# Altium project eEPS.PrjPcb
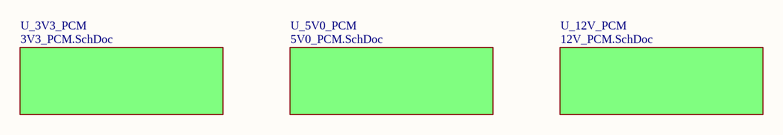
[diagram p0: PCMS.SchDoc]
9 sheets, 133 parts. Net scope: global (net labels, ports and power ports of the same name join across sheets).
Board file: eEPS.PcbDoc
Sheets:
  PCMS.SchDoc
    U_5V0_PCM = 5V0_PCM.SchDoc
    U_12V_PCM = 12V_PCM.SchDoc
    U_3V3_PCM = 3V3_PCM.SchDoc
  MCU.SchDoc
  CONNECTORS.SchDoc
    SHARED_HEADER = SHARED_HEADER.SchDoc
    JUMPERS = JUMPERS.SchDoc
  CURRENT_SENSE.SchDoc

## Sheet PCMS.SchDoc
size A4

### Sub-sheets
U_3V3_PCM = 3V3_PCM.SchDoc: no entries
U_5V0_PCM = 5V0_PCM.SchDoc: no entries
U_12V_PCM = 12V_PCM.SchDoc: no entries

## Sheet 5V0_PCM.SchDoc
size A4
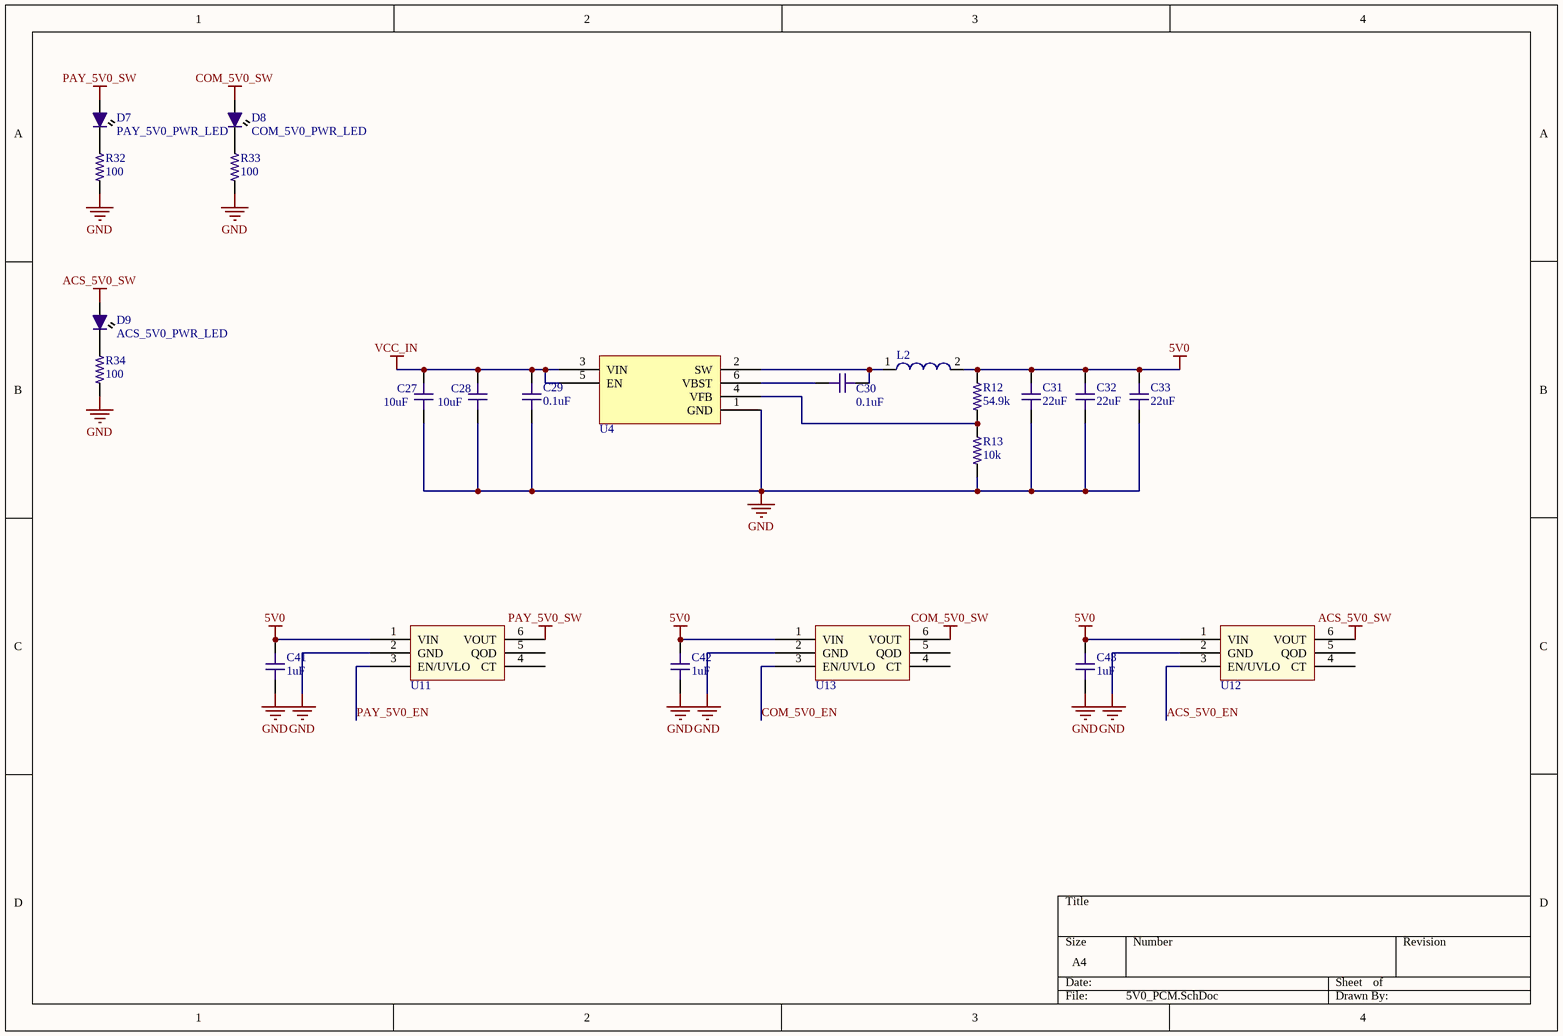
[diagram p1: 5V0_PCM.SchDoc]

### Parts
C27  value 10uF  [C1206-IPC]  (hidden comment: Cin)
C28  value 10uF  [C1206-IPC]  (hidden comment: Cin)
C29  value 0.1uF  [C0603-IPC]  (hidden comment: Cinx)
C30  value 0.1uF  [C0603-IPC]  (hidden comment: Cbst)
C31  value 22uF  [C0603-IPC]  (hidden comment: Cout)
C32  value 22uF  [C0603-IPC]  (hidden comment: Cout)
C33  value 22uF  [C0603-IPC]  (hidden comment: Cout)
C41  value 1uF  [C0603-IPC]  (hidden comment: Capacitor)
C42  value 1uF  [C0603-IPC]  (hidden comment: Capacitor)
C43  value 1uF  [C0603-IPC]  (hidden comment: Capacitor)
D7  PAY_5V0_PWR_LED  [LED0603-IPC]
D8  COM_5V0_PWR_LED  [LED0603-IPC]
D9  ACS_5V0_PWR_LED  [LED0603-IPC]
L2  74437349033  [WE-LHMI 7050]  (value not drawn)
R12  value 54.9k  [R0402-IPC]  (hidden comment: Rfbt)
R13  value 10k  [R0402-IPC]  (hidden comment: Rfbb)
R32  value 100  [R0603-IPC]  (hidden comment: 0603 Template)
R33  value 100  [R0603-IPC]  (hidden comment: 0603 Template)
R34  value 100  [R0603-IPC]  (hidden comment: 0603 Template)
U4  Buck  [SOT23-6_L]  (value not drawn)
U11  One Channel Load Switch  [TPS22810-Q1]  (value not drawn)
U12  One Channel Load Switch  [TPS22810-Q1]  (value not drawn)
U13  One Channel Load Switch  [TPS22810-Q1]  (value not drawn)

### Nets
5V0: C31.2 C32.2 C33.2 C41.2 C42.2 C43.2 L2.2 R12.2 U11.1(VIN) U12.1(VIN) U13.1(VIN)
ACS_5V0_SW: D9.A U12.6(VOUT)
COM_5V0_SW: D8.A U13.6(VOUT)
GND: C27.1 C28.1 C29.1 C31.1 C32.1 C33.1 C41.1 C42.1 C43.1 R13.1 R32.2 R33.2 R34.2 U4.1(GND) U11.2(GND) U12.2(GND) U13.2(GND)
PAY_5V0_SW: D7.A U11.6(VOUT)
VCC_IN: C27.2 C28.2 C29.2 U4.3(VIN) U4.5(EN)
ACS_5V0_EN: U12.3(EN/UVLO)
COM_5V0_EN: U13.3(EN/UVLO)
PAY_5V0_EN: U11.3(EN/UVLO)
NetC30_1: C30.1 U4.6(VBST)
NetC30_2: C30.2 L2.1 U4.2(SW)
NetD7_K: D7.K R32.1
NetD8_K: D8.K R33.1
NetD9_K: D9.K R34.1
NetR12_1: R12.1 R13.2 U4.4(VFB)

Not connected (* = marked no-connect by the designer): U11 4(CT) 5(QOD); U12 4(CT) 5(QOD); U13 4(CT) 5(QOD)

### Library data of the parts
C27 C28 = 15: Capacitor (1206) 10uF 25V X5R 1206; OrbitPartId: 15; Type: Passive; EIA Code: X5R; Max. Voltage: 25V; PartId: 1; Subtype: Capacitor; ComponentLink1Description: 12063D106KAT2A; ComponentLink1URL: https://www.digikey.ca/en/products/detail/avx-corporation/12063D106KAT2A/1950914
C29 C30 = 13: Cap Cer 0.1uF 10% 25V Cer Cap X7R 0603; OrbitPartId: 13; Type: Passive; EIA Code: X7R; Max. Voltage: 25V; PartId: 1; Subtype: Capacitor; ComponentLink1Description: C0603C104K3RACTU; ComponentLink1URL: https://www.digikey.ca/en/products/detail/kemet/C0603C104K3RACTU/416044?s=N4IgTCBcDaIMIAYBsCDMcCMCAsBpVASgIJwAqAqiALoC%2BQA
C31-C33 = 13: Cap Cer 22uF 10V X5R 0603; OrbitPartId: 13; Type: Passive; EIA Code: X5R; Max. Voltage: 10V; PartId: 1; Subtype: Capacitor; ComponentLink1Description: C1608X5R1A226M080AC; ComponentLink1URL: https://www.digikey.ca/en/products/detail/tdk-corporation/C1608X5R1A226M080AC/3661560?s=N4IgTCBcDaIMIEYBsAGAHADQKwCUEEEwwkBZdFfOEAXQF8g
C41-C43 = 13: Capacitor (0603); OrbitPartId: 13; EIA Code: X5R; Max. Voltage: 16V; Type: Passive; PartId: 1; Subtype: Capacitor
D7-D9 = LED 0603 SMD: Red PWR_LED; Supplier 1: Digi-Key; Supplier Part Number 1: 732-4966-1-ND
L2 = CMP-1353-00061-1: SMD Power Inductor WE-LHMI, L=3.3 µH; Manufacturer: Wuerth Elektronik; Inductance: 3.3 ÂµH; ComponentLink2Description: Datasheet; PartNumber: 74437349033; ComponentLink2URL: http://katalog.we-online.de/kataloge/eisos/media/pdf/74437349033.pdf; PackageReference: WE-LHMI 7050; ComponentLink1Description: Manufacturer URL; ComponentLink1URL: http://www.we-online.com
R12 = 19: 54.9k 1% 0402; OrbitPartId: 19; PartId: 1; Type: Passive; Subtype: Resistor; ComponentLink1Description: CRCW040254K9FKED; ComponentLink1URL: https://www.digikey.ca/en/products/detail/vishay-dale/crcw040254k9fked/1178205
R13 = 19: 10k 1% 0402; OrbitPartId: 19; PartId: 1; Type: Passive; Subtype: Resistor; ComponentLink1Description: CRCW040210K0FKED; ComponentLink1URL: https://www.digikey.ca/en/products/detail/vishay-dale/CRCW040210K0FKED/1178121
R32-R34 = 0603 Template: Chip Resistor, 0603, 51hms, 0.1W
U4 = TPS565208DDC: 4.5V tp 17V, 5A Synchronous Step-Down Voltage Regulator; ComponentLink1Description: Datasheet; ComponentLink1URL: http://www.ti.com/lit/ds/symlink/tps565208.pdf
U11-U13 = TPS22810-Q1: 2.7 - 18V @ 2A Max

## Sheet 12V_PCM.SchDoc
size A4
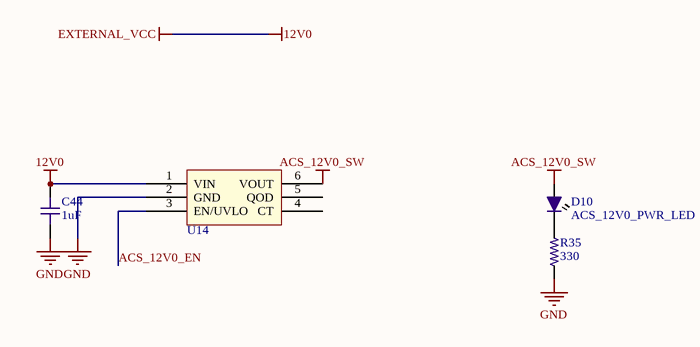
[diagram p2: 12V_PCM.SchDoc]

### Parts
C44  value 1uF  [C0603-IPC]  (hidden comment: Capacitor)
D10  ACS_12V0_PWR_LED  [LED0603-IPC]
R35  value 330  [R0603-IPC]  (hidden comment: 0603 Template)
U14  One Channel Load Switch  [TPS22810-Q1]  (value not drawn)

### Nets
12V0: C44.2 U14.1(VIN)  [also labelled EXTERNAL_VCC]
ACS_12V0_SW: D10.A U14.6(VOUT)
GND: C44.1 R35.2 U14.2(GND)
ACS_12V0_EN: U14.3(EN/UVLO)
NetD10_K: D10.K R35.1

Not connected (* = marked no-connect by the designer): U14 4(CT) 5(QOD)

### Library data of the parts
C44 = 13: as C41 on sheet 5V0_PCM; PartId: 1; Subtype: Capacitor
D10 = LED 0603 SMD: Red PWR_LED; Supplier 1: Digi-Key; Supplier Part Number 1: 732-4966-1-ND
R35 = 0603 Template: Chip Resistor, 0603, 51hms, 0.1W
U14 = TPS22810-Q1: 2.7 - 18V @ 2A Max

## Sheet 3V3_PCM.SchDoc
size A4
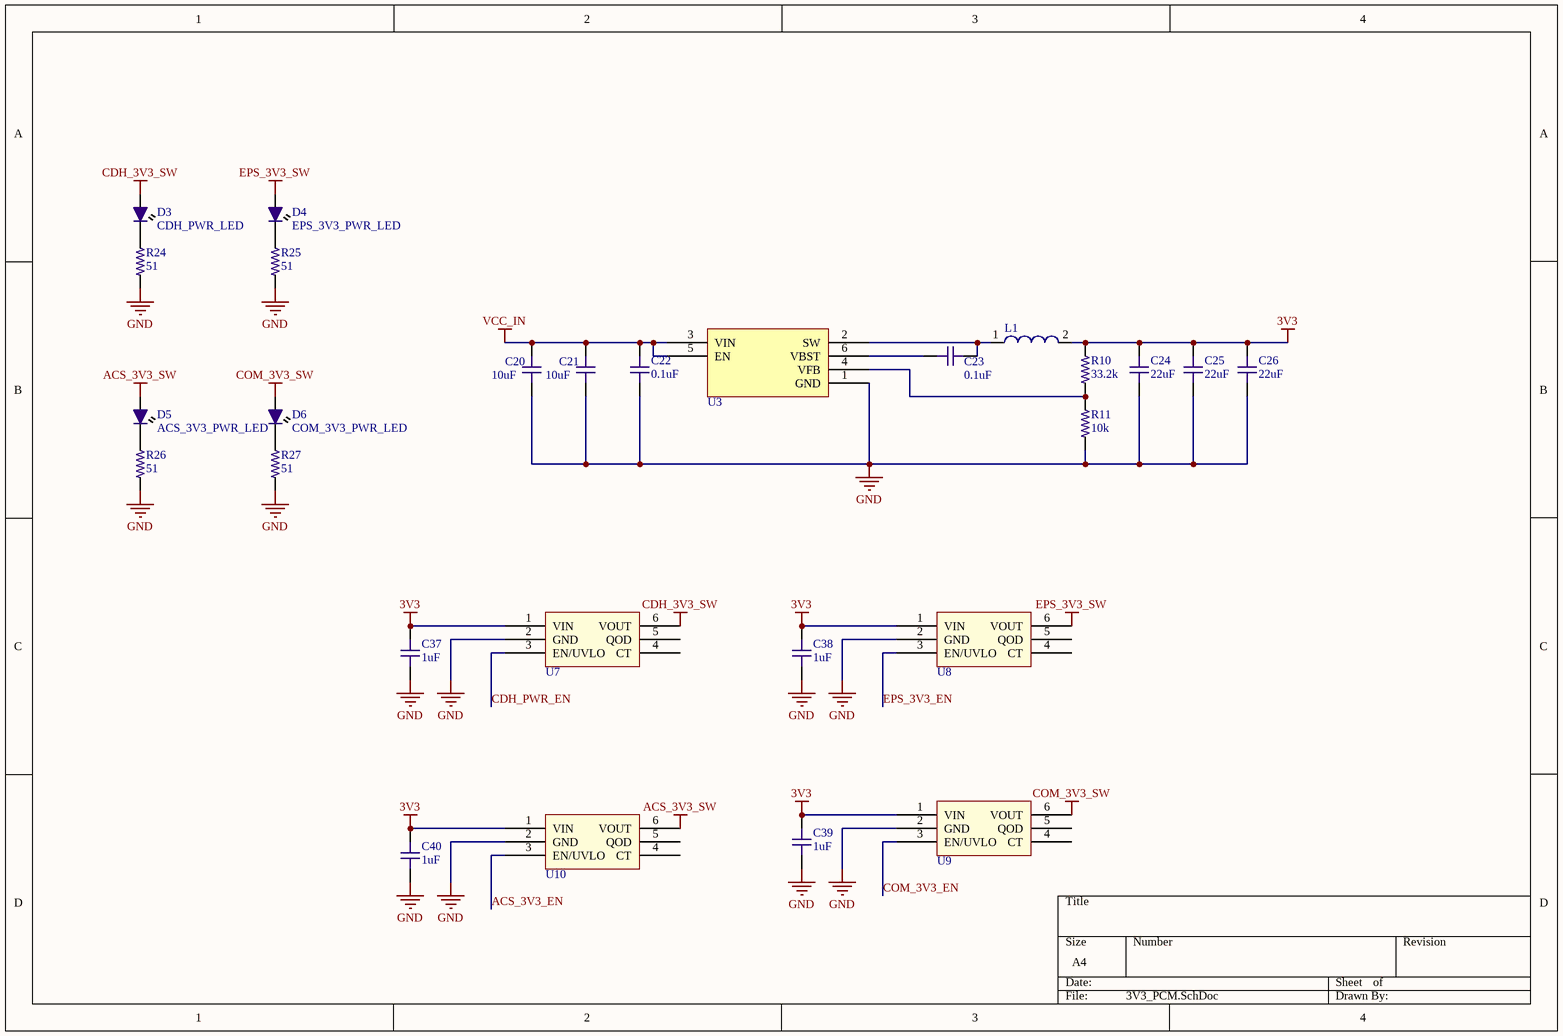
[diagram p3: 3V3_PCM.SchDoc]

### Parts
C20  value 10uF  [C1206-IPC]  (hidden comment: Cin)
C21  value 10uF  [C1206-IPC]  (hidden comment: Cin)
C22  value 0.1uF  [C0603-IPC]  (hidden comment: Cinx)
C23  value 0.1uF  [C0603-IPC]  (hidden comment: Cbst)
C24  value 22uF  [C0603-IPC]  (hidden comment: Cout)
C25  value 22uF  [C0603-IPC]  (hidden comment: Cout)
C26  value 22uF  [C0603-IPC]  (hidden comment: Cout)
C37  value 1uF  [C0603-IPC]  (hidden comment: Capacitor)
C38  value 1uF  [C0603-IPC]  (hidden comment: Capacitor)
C39  value 1uF  [C0603-IPC]  (hidden comment: Capacitor)
C40  value 1uF  [C0603-IPC]  (hidden comment: Capacitor)
D3  CDH_PWR_LED  [LED0603-IPC]
D4  EPS_3V3_PWR_LED  [LED0603-IPC]
D5  ACS_3V3_PWR_LED  [LED0603-IPC]
D6  COM_3V3_PWR_LED  [LED0603-IPC]
L1  74437349022  [WE-LHMI 7050]  (value not drawn)
R10  value 33.2k  [R0402-IPC]  (hidden comment: Rfbt)
R11  value 10k  [R0402-IPC]  (hidden comment: Rfbb)
R24  value 51  [R0603-IPC]  (hidden comment: 0603 Template)
R25  value 51  [R0603-IPC]  (hidden comment: 0603 Template)
R26  value 51  [R0603-IPC]  (hidden comment: 0603 Template)
R27  value 51  [R0603-IPC]  (hidden comment: 0603 Template)
U3  Buck  [SOT23-6_L]  (value not drawn)
U7  One Channel Load Switch  [TPS22810-Q1]  (value not drawn)
U8  One Channel Load Switch  [TPS22810-Q1]  (value not drawn)
U9  One Channel Load Switch  [TPS22810-Q1]  (value not drawn)
U10  One Channel Load Switch  [TPS22810-Q1]  (value not drawn)

### Nets
3V3: C24.2 C25.2 C26.2 C37.2 C38.2 C39.2 C40.2 L1.2 R10.2 U7.1(VIN) U8.1(VIN) U9.1(VIN) U10.1(VIN)
ACS_3V3_SW: D5.A U10.6(VOUT)
CDH_3V3_SW: D3.A U7.6(VOUT)
COM_3V3_SW: D6.A U9.6(VOUT)
EPS_3V3_SW: D4.A U8.6(VOUT)
GND: C20.1 C21.1 C22.1 C24.1 C25.1 C26.1 C37.1 C38.1 C39.1 C40.1 R11.1 R24.2 R25.2 R26.2 R27.2 U3.1(GND) U7.2(GND) U8.2(GND) U9.2(GND) U10.2(GND)
VCC_IN: C20.2 C21.2 C22.2 U3.3(VIN) U3.5(EN)
ACS_3V3_EN: U10.3(EN/UVLO)
CDH_PWR_EN: U7.3(EN/UVLO)
COM_3V3_EN: U9.3(EN/UVLO)
EPS_3V3_EN: U8.3(EN/UVLO)
NetC23_1: C23.1 U3.6(VBST)
NetC23_2: C23.2 L1.1 U3.2(SW)
NetD3_K: D3.K R24.1
NetD4_K: D4.K R25.1
NetD5_K: D5.K R26.1
NetD6_K: D6.K R27.1
NetR10_1: R10.1 R11.2 U3.4(VFB)

Not connected (* = marked no-connect by the designer): U7 4(CT) 5(QOD); U8 4(CT) 5(QOD); U9 4(CT) 5(QOD); U10 4(CT) 5(QOD)

### Library data of the parts
C20 C21 = 15: as C27 on sheet 5V0_PCM; EIA Code: X5R; Max. Voltage: 25V; PartId: 1; Subtype: Capacitor; ComponentLink1Description: 12063D106KAT2A; ComponentLink1URL: https://www.digikey.ca/en/products/detail/avx-corporation/12063D106KAT2A/1950914
C22 C23 = 13: as C29 on sheet 5V0_PCM; EIA Code: X7R; Max. Voltage: 25V; PartId: 1; Subtype: Capacitor; ComponentLink1Description: C0603C104K3RACTU; ComponentLink1URL: https://www.digikey.ca/en/products/detail/kemet/C0603C104K3RACTU/416044?s=N4IgTCBcDaIMIAYBsCDMcCMCAsBpVASgIJwAqAqiALoC%2BQA
C24-C26 = 13: as C31 on sheet 5V0_PCM; EIA Code: X5R; Max. Voltage: 10V; PartId: 1; Subtype: Capacitor; ComponentLink1Description: C1608X5R1A226M080AC; ComponentLink1URL: https://www.digikey.ca/en/products/detail/tdk-corporation/C1608X5R1A226M080AC/3661560?s=N4IgTCBcDaIMIEYBsAGAHADQKwCUEEEwwkBZdFfOEAXQF8g
C37-C40 = 13: as C41 on sheet 5V0_PCM; PartId: 1; Subtype: Capacitor
D3-D6 = LED 0603 SMD: Red PWR_LED; Supplier 1: Digi-Key; Supplier Part Number 1: 732-4966-1-ND
L1 = CMP-1353-00064-1: SMD Power Inductor WE-LHMI, L=2.2 µH; Manufacturer: Wuerth Elektronik; Inductance: 2.2 ÂµH; ComponentLink1Description: Manufacturer URL; ComponentLink2Description: Datasheet; PartNumber: 74437349022; ComponentLink2URL: http://katalog.we-online.de/kataloge/eisos/media/pdf/74437349022.pdf; ComponentLink1URL: http://www.we-online.com; PackageReference: WE-LHMI 7050
R10 = 19: 33.2k 1% 0402; OrbitPartId: 19; PartId: 1; Type: Passive; Subtype: Resistor; ComponentLink1Description: CRCW040233K2FKED; ComponentLink1URL: https://www.digikey.ca/en/products/detail/vishay-dale/CRCW040233K2FKED/1178179
R11 = 19: 10k 1% 0402; OrbitPartId: 19; PartId: 1; Type: Passive; Subtype: Resistor; ComponentLink1Description: CRCW040210K0FKED; ComponentLink1URL: https://www.digikey.ca/en/products/detail/vishay-dale/CRCW040210K0FKED/1178121
R24-R27 = 0603 Template: Chip Resistor, 0603, 51hms, 0.1W
U3 = TPS565208DDC: as U4 on sheet 5V0_PCM; ComponentLink1Description: Datasheet; ComponentLink1URL: http://www.ti.com/lit/ds/symlink/tps565208.pdf
U7-U10 = TPS22810-Q1: 2.7 - 18V @ 2A Max

## Sheet MCU.SchDoc
size A4
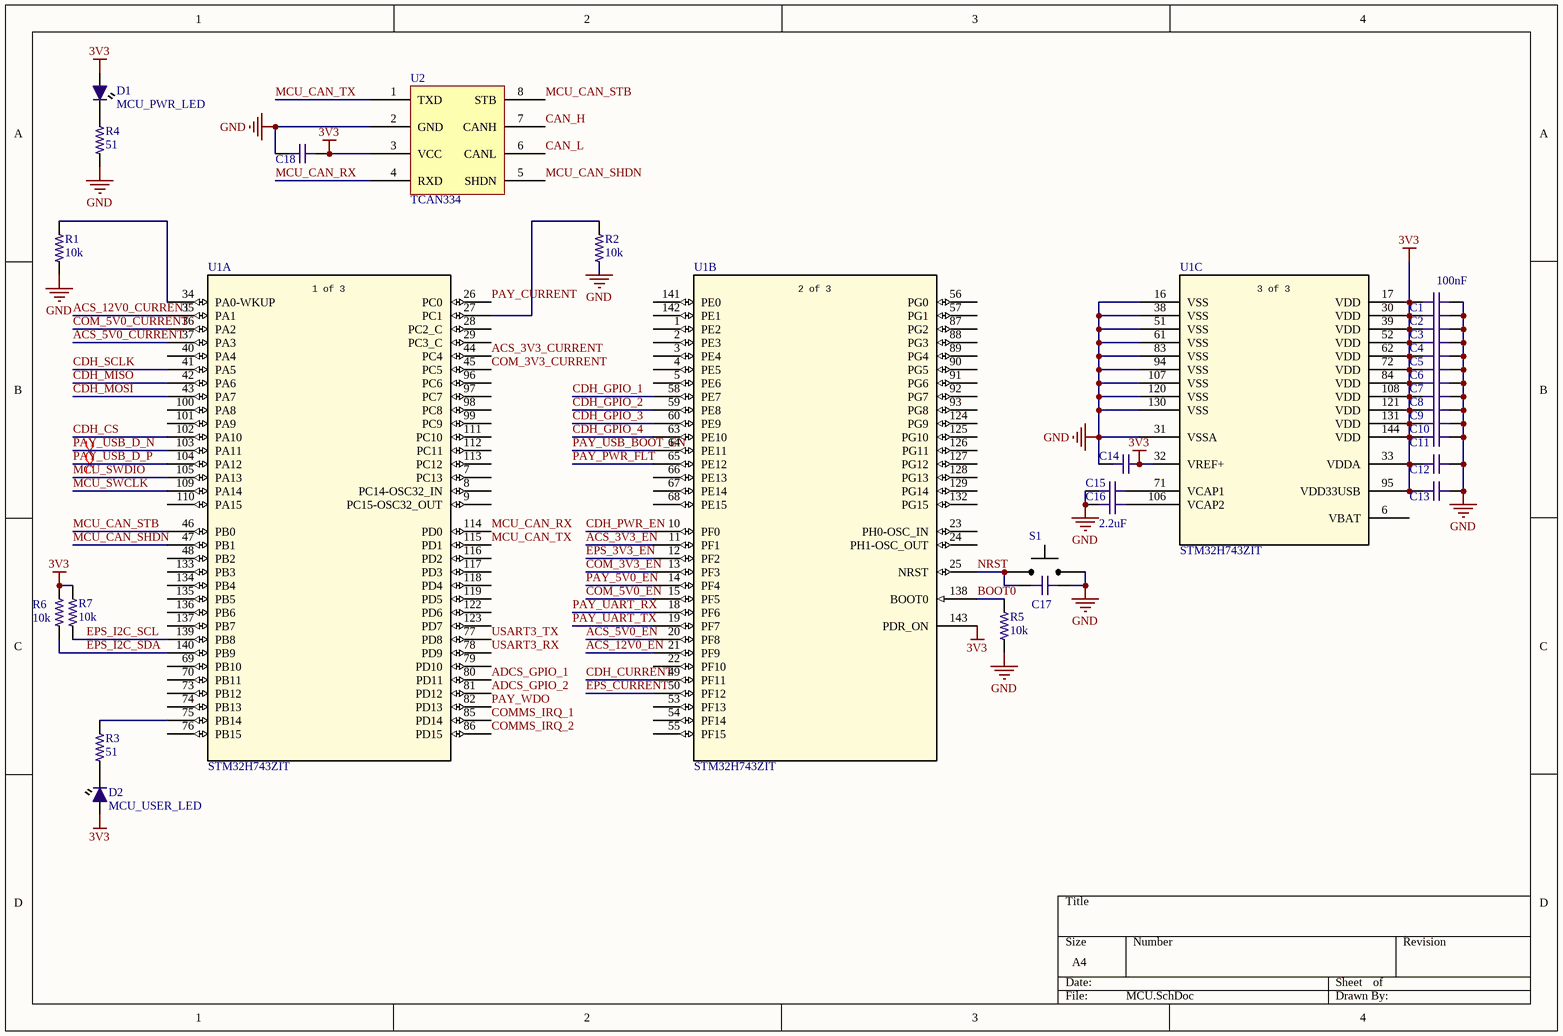
[diagram p4: MCU.SchDoc]

### Parts
C1  value 100nF  [C0603-IPC]  (hidden comment: Capacitor)
C2  Capacitor  [C0603-IPC]  (value not drawn)
C3  Capacitor  [C0603-IPC]  (value not drawn)
C4  Capacitor  [C0603-IPC]  (value not drawn)
C5  Capacitor  [C0603-IPC]  (value not drawn)
C6  Capacitor  [C0603-IPC]  (value not drawn)
C7  Capacitor  [C0603-IPC]  (value not drawn)
C8  Capacitor  [C0603-IPC]  (value not drawn)
C9  Capacitor  [C0603-IPC]  (value not drawn)
C10  Capacitor  [C0603-IPC]  (value not drawn)
C11  Capacitor  [C0603-IPC]  (value not drawn)
C12  Capacitor  [C0603-IPC]  (value not drawn)
C13  Capacitor  [C0603-IPC]  (value not drawn)
C14  Capacitor  [C0603-IPC]  (value not drawn)
C15  Capacitor  [C0603-IPC]  (value not drawn)
C16  value 2.2uF  [C0603-IPC]  (hidden comment: Capacitor)
C17  Capacitor  [C0603-IPC]  (value not drawn)
C18  Capacitor  [C0603-IPC]  (value not drawn)
D1  MCU_PWR_LED  [LED0603-IPC]
D2  MCU_USER_LED  [LED0603-IPC]
R1  value 10k  [R0603-IPC]  (hidden comment: Resistor)
R2  value 10k  [R0603-IPC]  (hidden comment: Resistor)
R3  value 51  [R0603-IPC]  (hidden comment: Resistor)
R4  value 51  [R0603-IPC]  (hidden comment: 0603 Template)
R5  value 10k  [R0603-IPC]  (hidden comment: Resistor)
R6  value 10k  [R0603-IPC]  (hidden comment: Resistor)
R7  value 10k  [R0603-IPC]  (hidden comment: Resistor)
S1  PTS810  [PTS810]  (value not drawn)
U1  STM32H743ZIT  [LQFP50P2200X2200X160-144N]  (parts A,B,C of 3)
U2  TCAN334  [SOIC127P600X175-8N]

### Nets
3V3: C1.1 C2.1 C3.1 C4.1 C5.1 C6.1 C7.1 C8.1 C9.1 C10.1 C11.1 C12.1 C13.1 C14.2 C18.2 D1.A D2.A R6.2 R7.2 U1.17(VDD) U1.30(VDD) U1.32(VREF+) U1.33(VDDA) U1.39(VDD) U1.52(VDD) U1.62(VDD) U1.72(VDD) U1.84(VDD) U1.95(VDD33USB) U1.108(VDD) U1.121(VDD) U1.131(VDD) U1.143(PDR_ON) U1.144(VDD) U2.3(VCC)
GND: C1.2 C2.2 C3.2 C4.2 C5.2 C6.2 C7.2 C8.2 C9.2 C10.2 C11.2 C12.2 C13.2 C14.1 C15.1 C16.1 C17.2 C18.1 R1.1 R2.1 R4.2 R5.1 S1.2 U1.16(VSS) U1.31(VSSA) U1.38(VSS) U1.51(VSS) U1.61(VSS) U1.83(VSS) U1.94(VSS) U1.107(VSS) U1.120(VSS) U1.130(VSS) U2.2(GND)
ACS_3V3_CURRENT: U1.44(PC4)
ACS_3V3_EN: U1.11(PF1)
ACS_5V0_CURRENT: U1.37(PA3)
ACS_5V0_EN: U1.20(PF8)
ACS_12V0_CURRENT: U1.35(PA1)
ACS_12V0_EN: U1.21(PF9)
ADCS_GPIO_1: U1.80(PD11)
ADCS_GPIO_2: U1.81(PD12)
BOOT0: R5.2 U1.138(BOOT0)
CAN_H: U2.7(CANH)
CAN_L: U2.6(CANL)
CDH_CS: U1.102(PA10)
CDH_CURRENT: U1.49(PF11)
CDH_GPIO_1: U1.58(PE7)
CDH_GPIO_2: U1.59(PE8)
CDH_GPIO_3: U1.60(PE9)
CDH_GPIO_4: U1.63(PE10)
CDH_MISO: U1.42(PA6)
CDH_MOSI: U1.43(PA7)
CDH_PWR_EN: U1.10(PF0)
CDH_SCLK: U1.41(PA5)
COM_3V3_CURRENT: U1.45(PC5)
COM_3V3_EN: U1.13(PF3)
COM_5V0_CURRENT: U1.36(PA2)
COM_5V0_EN: U1.15(PF5)
COMMS_IRQ_1: U1.85(PD14)
COMMS_IRQ_2: U1.86(PD15)
EPS_3V3_EN: U1.12(PF2)
EPS_CURRENT: U1.50(PF12)
EPS_I2C_SCL: R7.1 U1.139(PB8)
EPS_I2C_SDA: R6.1 U1.140(PB9)
MCU_CAN_RX: U1.114(PD0) U2.4(RXD)
MCU_CAN_SHDN: U1.47(PB1) U2.5(SHDN)
MCU_CAN_STB: U1.46(PB0) U2.8(STB)
MCU_CAN_TX: U1.115(PD1) U2.1(TXD)
MCU_SWCLK: U1.109(PA14)
MCU_SWDIO: U1.105(PA13)
NRST: C17.1 S1.1 U1.25(NRST)
PAY_5V0_EN: U1.14(PF4)
PAY_CURRENT: U1.26(PC0)
PAY_PWR_FLT: U1.65(PE12)
PAY_UART_RX: U1.18(PF6)
PAY_UART_TX: U1.19(PF7)
PAY_USB_BOOT_EN: U1.64(PE11)
PAY_USB_D_N: U1.103(PA11)
PAY_USB_D_P: U1.104(PA12)
PAY_WDO: U1.82(PD13)
USART3_RX: U1.78(PD9)
USART3_TX: U1.77(PD8)
NetC15_2: C15.2 U1.71(VCAP1)
NetC16_2: C16.2 U1.106(VCAP2)
NetD1_K: D1.K R4.1
NetD2_K: D2.K R3.1
NetR1_2: R1.2 U1.34(PA0-WKUP)
NetR2_2: R2.2 U1.27(PC1)
NetR3_2: R3.2 U1.75(PB14)

Not connected (* = marked no-connect by the designer): U1 1(PE2) 2(PE3) 3(PE4) 4(PE5) 5(PE6) 6(VBAT) 7(PC13) 8(PC14-OSC32_IN) 9(PC15-OSC32_OUT) 22(PF10) 23(PH0-OSC_IN) 24(PH1-OSC_OUT) 28(PC2_C) 29(PC3_C) 40(PA4) 48(PB2) 53(PF13) 54(PF14) 55(PF15) 56(PG0) 57(PG1) 66(PE13) 67(PE14) 68(PE15) 69(PB10) 70(PB11) 73(PB12) 74(PB13) 76(PB15) 79(PD10) 87(PG2) 88(PG3) 89(PG4) 90(PG5) 91(PG6) 92(PG7) 93(PG8) 96(PC6) 97(PC7) 98(PC8) 99(PC9) 100(PA8) 101(PA9) 110(PA15) 111(PC10) 112(PC11) 113(PC12) 116(PD2) 117(PD3) 118(PD4) 119(PD5) 122(PD6) 123(PD7) 124(PG9) 125(PG10) 126(PG11) 127(PG12) 128(PG13) 129(PG14) 132(PG15) 133(PB3) 134(PB4) 135(PB5) 136(PB6) 137(PB7) 141(PE0) 142(PE1)

### Layout directives
differential pair: PAY_USB_D_N, PAY_USB_D_P

### Notes on the sheet
- (in symbol 25, part A) 1 of 3
- (in symbol 25, part B) 2 of 3
- (in symbol 25, part C) 3 of 3

### Library data of the parts
C1-C13 C17 C18 = 13: Chip Capacitor, 0603, 100nF, 10V, X7R; OrbitPartId: 13; Type: Passive; EIA Code: X7R; Max. Voltage: 10V; PartId: 1; Subtype: Capacitor
  C2-C13 C17 C18: Value: 100nF
C14 = 13: Chip Capacitor, 0603, 10nF, 10V, X7R; OrbitPartId: 13; Type: Passive; EIA Code: X7R; Max. Voltage: 10V; Value: 10nF; PartId: 1; Subtype: Capacitor
C15 C16 = 13: Chip Capacitor, 0603, 2.2uF, 10V, X7R; OrbitPartId: 13; Type: Passive; EIA Code: X7R; Max. Voltage: 10V; PartId: 1; Subtype: Capacitor
  C15: Value: 2.2uF
D1 = LED 0603 SMD: Red PWR_LED; Supplier 1: Digi-Key; Supplier Part Number 1: 732-4966-1-ND
D2 = LED 0603 SMD: Blue DEBUG_LED; Supplier 1: Digi-Key; Supplier Part Number 1: 732-4966-1-ND
R1-R3 R5-R7 = 20: Resistor (0603); OrbitPartId: 20; PartId: 1; Type: Passive; Subtype: Resistor
R4 = 0603 Template: Chip Resistor, 0603, 51hms, 0.1W
S1 = 39: PTS810 Switch (Tactile); OrbitPartId: 39; Manufacturer: C&K; Part Number: PTS810 SJM 250 SMTR LFS; PartId: 1; Supplier 1: Digi-Key; Supplier Part Number 1: CKN10502CT-ND; Type: Switch; Subtype: Tactile
U1 = 25: STM32H743ZIT MCU; OrbitPartId: 25; Manufacturer: STMicroelectronics; Part Number: STM32H743ZIT6; Subtype: Microcontroller; PartId: 1; Supplier 1: Digi-Key; Supplier Part Number 1: 497-17721-ND; Type: Integrated Circuit
U2 = 26: TCAN334 CAN Transceiver; OrbitPartId: 26; Manufacturer: Texas Instruments; Part Number: TCAN334DCNT; PartId: 1; Supplier 1: Digi-Key; Supplier Part Number 1: 296-44503-1-ND; Type: Integrated Circuit; Subtype: CAN Transceiver

## Sheet CONNECTORS.SchDoc
size A4
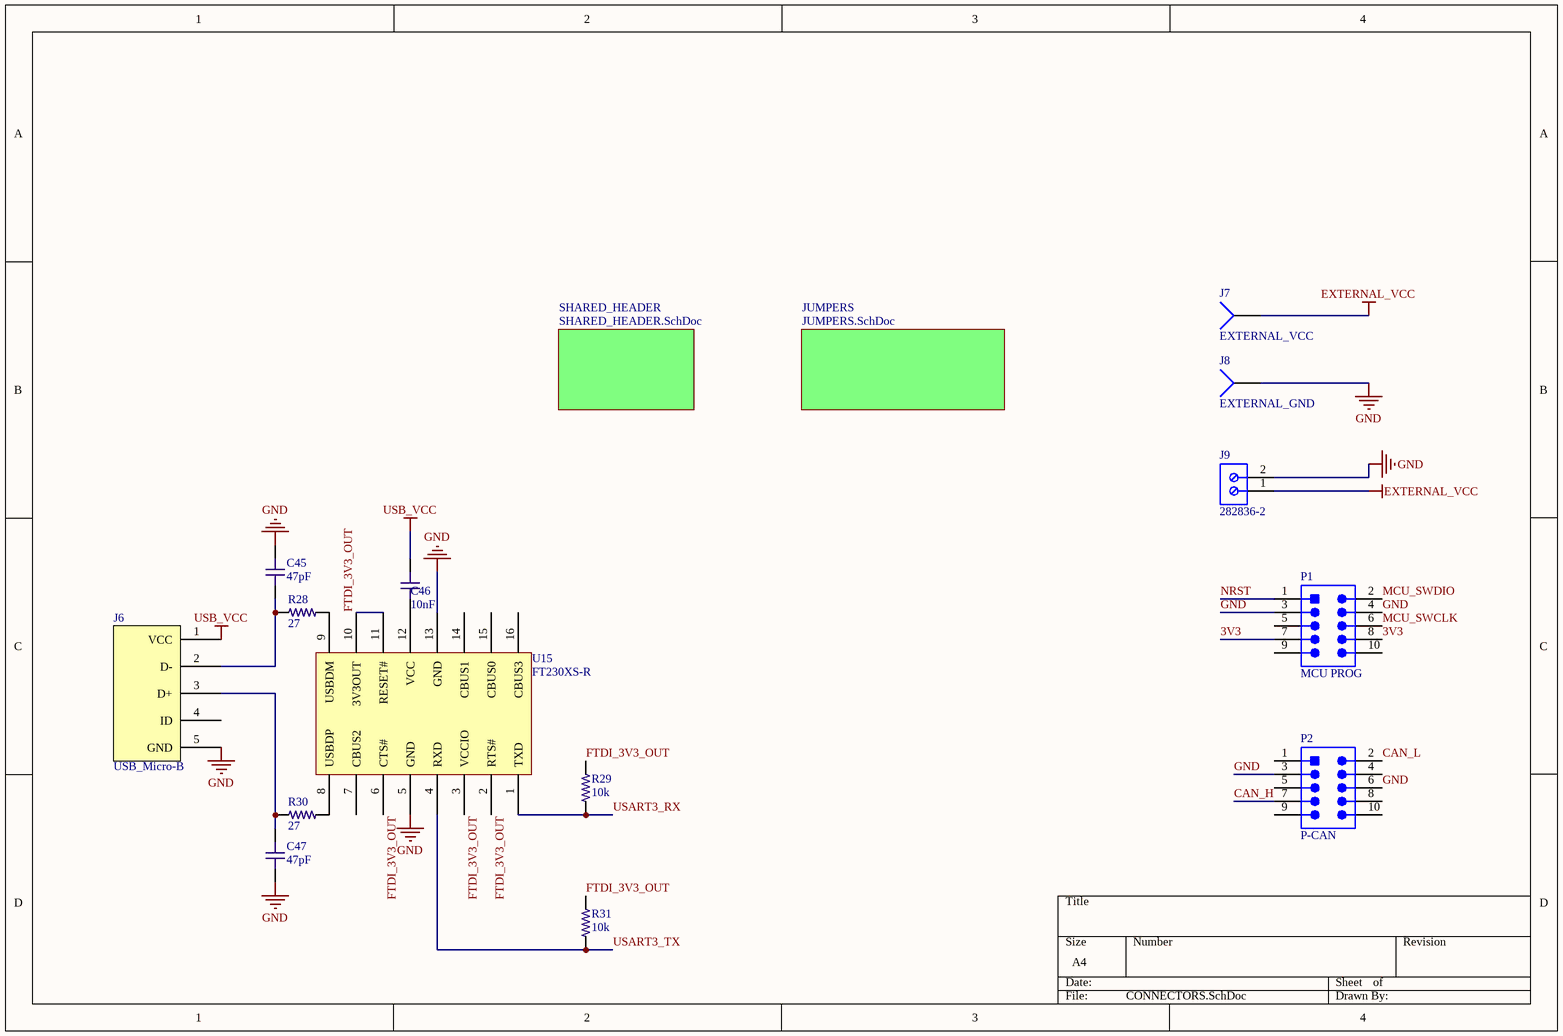
[diagram p5: CONNECTORS.SchDoc]

### Parts
C45  value 47pF  [C0603-IPC]  (hidden comment: 0603 Capacitor Template)
C46  value 10nF  [C0603-IPC]  (hidden comment: 0603 Capacitor Template)
C47  value 47pF  [C0603-IPC]  (hidden comment: 0603 Capacitor Template)
J6  USB_Micro-B  [USB_Micro-B]
J7  EXTERNAL_VCC  [Red-BananaJack]
J8  EXTERNAL_GND  [Black-BananaJack]
J9  282836-2  [TECO-282836-2_V]
P1  MCU PROG  [3M-N2510-6002-10_V]
P2  P-CAN  [3M-N2510-6002-10_V]
R28  value 27  [R0603-IPC]  (hidden comment: 0603 Template)
R29  value 10k  [R0603-IPC]  (hidden comment: 0603 Template)
R30  value 27  [R0603-IPC]  (hidden comment: 0603 Template)
R31  value 10k  [R0603-IPC]  (hidden comment: 0603 Template)
U15  FT230XS-R  [SOP64P600X175-16N]

### Sub-sheets
JUMPERS = JUMPERS.SchDoc: no entries
SHARED_HEADER = SHARED_HEADER.SchDoc: no entries

### Nets
3V3: P1.7 P1.8
EXTERNAL_VCC: J7.1 J9.1  [project net 12V0]
GND: C45.2 C47.1 J6.5(GND) J8.1 J9.2 P1.3 P1.4 P2.3 P2.6 U15.5(GND) U15.13(GND)
USB_VCC: C46.2 J6.1(VCC)
CAN_H: P2.7
CAN_L: P2.2
FTDI_3V3_OUT: R29.2 R31.2 U15.2(RTS#) U15.3(VCCIO) U15.6(CTS#) U15.10(3V3OUT) U15.11(RESET#)
MCU_SWCLK: P1.6
MCU_SWDIO: P1.2
NRST: P1.1
USART3_RX: R29.1 U15.1(TXD)
USART3_TX: R31.1 U15.4(RXD)
NetC45_1: C45.1 J6.2(D-) R28.1
NetC46_1: C46.1 U15.12(VCC)
NetC47_2: C47.2 J6.3(D+) R30.1
NetR28_2: R28.2 U15.9(USBDM)
NetR30_2: R30.2 U15.8(USBDP)

Not connected (* = marked no-connect by the designer): J6 4(ID); P1 5 9 10; P2 1 4 5 8 9 10; U15 7(CBUS2) 14(CBUS1) 15(CBUS0) 16(CBUS3)

### Library data of the parts
C45-C47 = 0603 Capacitor Template: Chip Capacitor, 0603, ??nF, 10V, X7R; EIA Code: X7R; Max. Voltage: 10V
J6 = 31: USB Micro-B; OrbitPartId: 31; Manufacturer: Amphenol ICC (FCI); Part Number: 10118193-0001LF; PartId: 1; Supplier 1: Digi-Key; Supplier Part Number 1: 609-4616-1-ND; Type: Connector; Subtype: USB
J7 J8 = Socket: LatestRevisionDate: 17-Jul-2002; LatestRevisionNote: Re-released for DXP Platform.; Publisher: Altium Limited
J9 = CMP-1684-00017-1: Female Header, Pitch 5 mm, 1 x 2 Position, Height 10 mm, Tail Length 3.5 mm, Rohs, Bulk; Manufacturer: TE Connectivity; Wire Gauge: 16-30AWG; Product Training Modules: Wire-to-BoardEurostyleTerminalBlocks; Clamp Material - Plating: Brass-NickelPlated; Voltage: 300V; Mating Orientation: HorizontalwithBoard; Current: 13.5A; Pitch: 0.197"(5.00mm); Screw Thread: M3; 3D Model: 282836-2.pdf; Other Names: 5ULV-02B / A98076; Dynamic Catalog: BuchananSeries; Number of Levels: 1; Torque - Screw: 0.68Nm(6Lb-In); Featured Product: EurostyleTerminalBlockConnectors; Positions Per Level: 2; Wire Termination: Screw-RisingCageClamp; Datasheet URL: http://www.te.com.cn/commerce/DocumentDelivery/DDEController?Action=showdoc&DocId=Catalog+Section%7F1308389_EUROSTYLE_TERMINAL_BLOCKS%7F0607%7Fpdf%7FEnglish%7FENG_CS_1308389_EUROSTYLE_TERMINAL_BLOCKS_0607.pdf%7F282836-2; Color: Green; Family: TerminalBlocks-WiretoBoard; RoHS Information: 282836-2StatementofCompliance; Standard Package: 300; Contact Material - Plating: Brass-TinPlated; Manufacturer URL: http://www.te.com; Housing Material: Polyamide(PA66),Nylon6/6; Features: Interlocking(Side); Package Description: Female Header, Pitch 5 mm, 1 x 2 Position, Height 10 mm, Tail Length 3.5 mm; Mounting Type: ThroughHole; Package Reference: THD; Packaging: Bulk; Series: Buchanan; Category: Connectors,Interconnects; Screw Material - Plating: Brass-NickelPlated
P1 P2 = CMP-2000-06794-1: Male Header, Pitch 2.54 mm, 2 x 5 Postion, Height 9.91 mm, Tail Length 2.84 mm, -55 to 105 degC, RoHS, Bulk; PartNumber: N2510; Manufacturer: 3M; Package Version: Rev. M, 08/2014; Rad Hard: No; No. of Rows: 2; Number of Contacts: 10; Pitch: 2.54mm; Termination Method: Solder; Manufacturer URL: http://www.3m.com/; Package Description: 10-Pin Through Hole Device, Body 20.02 x 8.59 mm, Pitch 2.54 mm; Gender: Male; Number of Rows: 2; Orientation: Straight; Contact Plating: GoldOverNickel; Packaging: Rail/Tube; Mounting Technology: ThroughHole; Datasheet URL: https://datasheet.ciiva.com/11746/0900766b807b18da-11746957.pdf; Package Reference: N2510-6002-10; Datasheet Version: 05/2007; No. of Positions: 10; Package URL: http://multimedia.3m.com/mws/media/330367O/3mtm-100-in-4-wall-hdr-rohs-lp-straightra-hitemp-ts0770.pdf; Type: ShroudedHeader
R28-R31 = 0603 Template: Chip Resistor, 0603, ??k ohms, 0.1W
U15 = FT230XS-R: FT230XS-R USB to UART IC; OrbitPartId: 29; Manufacturer: FTDI, Future Technology Devices International Ltd; Subtype: FTDI; Part Number: FT230XS-R; PartId: 1; Supplier 1: Digi-Key; Supplier Part Number 1: 768-1135-1-ND; Type: Integrated Circuit

## Sheet SHARED_HEADER.SchDoc
size A4
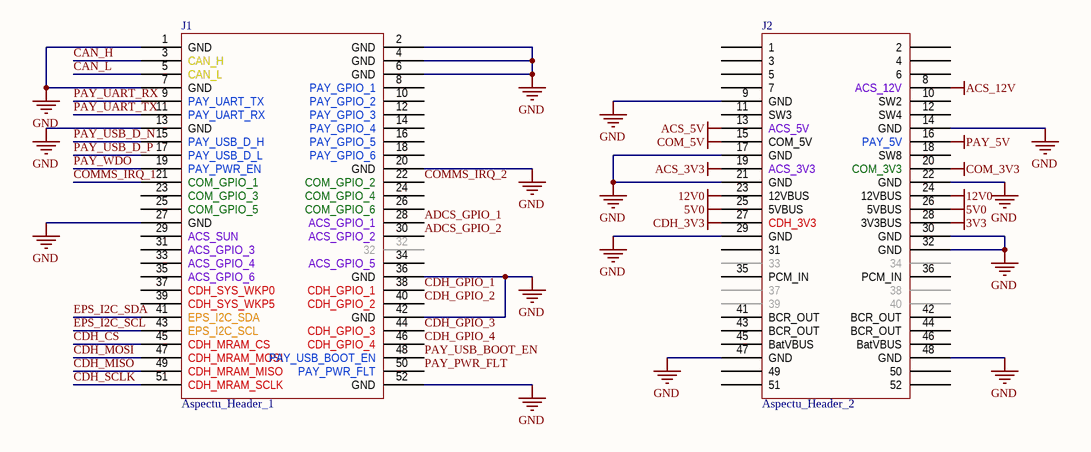
[diagram p6: SHARED_HEADER.SchDoc]

### Parts
J1  Aspectu_Header_1  [Aspectu_Header_1]
J2  Aspectu_Header_2  [Aspectu_Header_2]

### Nets
3V3: J2.28(3V3BUS)
5V0: J2.25(5VBUS) J2.26(5VBUS)
12V0: J2.23(12VBUS) J2.24(12VBUS)
ACS_3V3: J2.19(ACS_3V3)
ACS_5V: J2.13(ACS_5V)
ACS_12V: J2.8(ACS_12V)
CDH_3V3: J2.27(CDH_3V3)
COM_3V3: J2.20(COM_3V3)
COM_5V: J2.15(COM_5V)
GND: J1.1(GND) J1.2(GND) J1.4(GND) J1.6(GND) J1.7(GND) J1.13(GND) J1.20(GND) J1.27(GND) J1.36(GND) J1.42(GND) J1.52(GND) J2.9(GND) J2.14(GND) J2.17(GND) J2.21(GND) J2.22(GND) J2.29(GND) J2.30(GND) J2.32(GND) J2.47(GND) J2.48(GND)
PAY_5V: J2.16(PAY_5V)
ADCS_GPIO_1: J1.28(ACS_GPIO_1)
ADCS_GPIO_2: J1.30(ACS_GPIO_2)
CAN_H: J1.3(CAN_H)
CAN_L: J1.5(CAN_L)
CDH_CS: J1.45(CDH_MRAM_CS)
CDH_GPIO_1: J1.38(CDH_GPIO_1)
CDH_GPIO_2: J1.40(CDH_GPIO_2)
CDH_GPIO_3: J1.44(CDH_GPIO_3)
CDH_GPIO_4: J1.46(CDH_GPIO_4)
CDH_MISO: J1.49(CDH_MRAM_MISO)
CDH_MOSI: J1.47(CDH_MRAM_MOSI)
CDH_SCLK: J1.51(CDH_MRAM_SCLK)
COMMS_IRQ_1: J1.21(COM_GPIO_1)
COMMS_IRQ_2: J1.22(COM_GPIO_2)
EPS_I2C_SCL: J1.43(EPS_I2C_SCL)
EPS_I2C_SDA: J1.41(EPS_I2C_SDA)
PAY_PWR_FLT: J1.50(PAY_PWR_FLT)
PAY_UART_RX: J1.9(PAY_UART_TX)
PAY_UART_TX: J1.11(PAY_UART_RX)
PAY_USB_BOOT_EN: J1.48(PAY_USB_BOOT_EN)
PAY_USB_D_N: J1.15(PAY_USB_D_H)
PAY_USB_D_P: J1.17(PAY_USB_D_L)
PAY_WDO: J1.19(PAY_PWR_EN)

Not connected (* = marked no-connect by the designer): J1 8(PAY_GPIO_1) 10(PAY_GPIO_2) 12(PAY_GPIO_3) 14(PAY_GPIO_4) 16(PAY_GPIO_5) 18(PAY_GPIO_6) 23(COM_GPIO_3) 24(COM_GPIO_4) 25(COM_GPIO_5) 26(COM_GPIO_6) 29(ACS_SUN) 31(ACS_GPIO_3) 32 33(ACS_GPIO_4) 34(ACS_GPIO_5) 35(ACS_GPIO_6) 37(CDH_SYS_WKP0) 39(CDH_SYS_WKP5); J2 1 2 3 4 5 6 7 10(SW2) 11(SW3) 12(SW4) 18(SW8) 31 33 34 35(PCM_IN) 36(PCM_IN) 37 38 39 40 41(BCR_OUT) 42(BCR_OUT) 43(BCR_OUT) 44(BCR_OUT) 45(BatVBUS) 46(BatVBUS) 49 50 51 52

### Library data of the parts
J1 = 1: Aspectu Header 1; OrbitPartId: 1; PartId: 1; Type: Connector; Subtype: Header
J2 = 2: Aspectu Header 2; OrbitPartId: 2; PartId: 2; Type: Connector; Subtype: Header

## Sheet JUMPERS.SchDoc
size A4
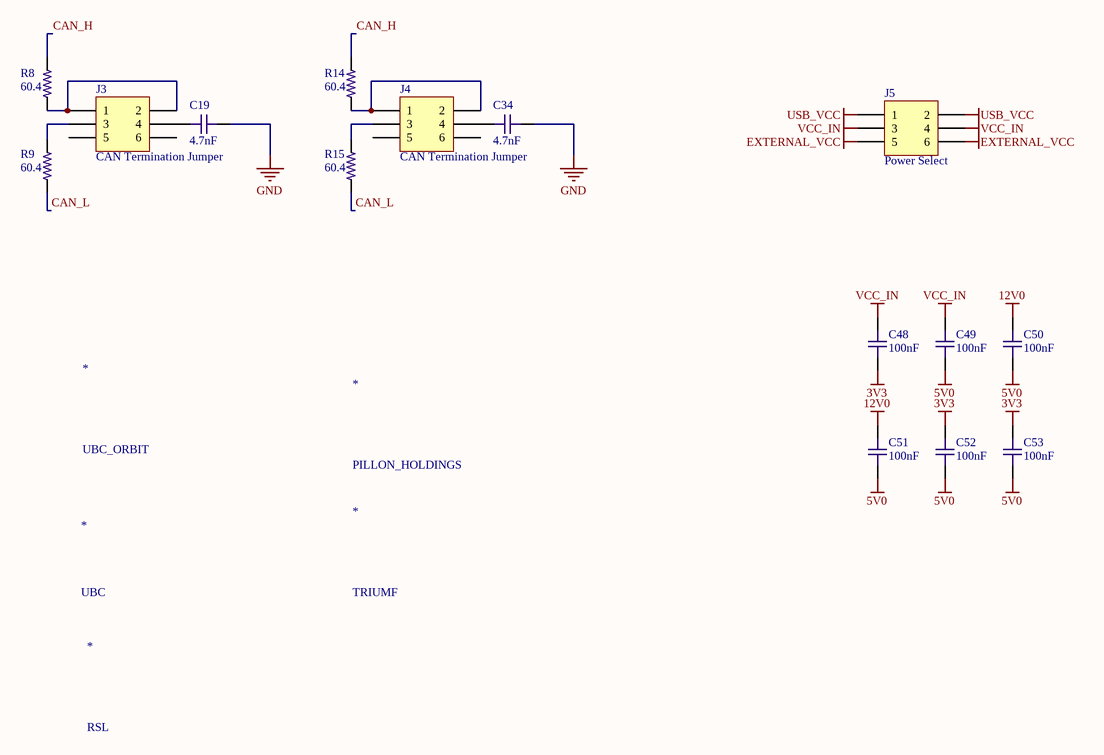
[diagram p7: JUMPERS.SchDoc]

### Parts
(Parts that share a designator on the sheet are numbered #1, #2 ... from top to bottom, then left to right.)
*#1  UBC_ORBIT  [UBC_ORBIT]
*#2  PILLON_HOLDINGS  [PILLON_HOLDINGS]
*#3  UBC  [UBC]
*#4  TRIUMF  [TRIUMF]
*#5  RSL  [RSL]
?  CSA  [CSA]  (value not drawn)
C19  value 4.7nF  [C0603-IPC]  (hidden comment: 0603 Capacitor Template)
C34  value 4.7nF  [C0603-IPC]  (hidden comment: 0603 Capacitor Template)
C48  value 100nF  [C0603-IPC]  (hidden comment: Capacitor)
C49  value 100nF  [C0603-IPC]  (hidden comment: Capacitor)
C50  value 100nF  [C0603-IPC]  (hidden comment: Capacitor)
C51  value 100nF  [C0603-IPC]  (hidden comment: Capacitor)
C52  value 100nF  [C0603-IPC]  (hidden comment: Capacitor)
C53  value 100nF  [C0603-IPC]  (hidden comment: Capacitor)
J3  CAN Termination Jumper  [HDR2X3]
J4  CAN Termination Jumper  [HDR2X3]
J5  Power Select  [HDR2X3]
R8  value 60.4  [R2512-IPC]  (hidden comment: 2512 Template)
R9  value 60.4  [R2512-IPC]  (hidden comment: 2512 Template)
R14  value 60.4  [R2512-IPC]  (hidden comment: 2512 Template)
R15  value 60.4  [R2512-IPC]  (hidden comment: 2512 Template)

### Nets
3V3: C48.1 C52.2 C53.2
5V0: C49.1 C50.1 C51.1 C52.1 C53.1
12V0: C50.2 C51.2 J5.5 J5.6  [also labelled EXTERNAL_VCC]
GND: C19.2 C34.2
USB_VCC: J5.1 J5.2
VCC_IN: C48.2 C49.2 J5.3 J5.4
CAN_H: R8.2 R14.2
CAN_L: R9.1 R15.1
NetC19_1: C19.1 J3.4
NetC34_1: C34.1 J4.4
NetJ3_1: J3.1 J3.2 R8.1
NetJ3_3: J3.3 R9.2
NetJ4_1: J4.1 J4.2 R14.1
NetJ4_3: J4.3 R15.2

Not connected (* = marked no-connect by the designer): J3 5 6; J4 5 6

### Library data of the parts
*#1 = 3: UBC Orbit Logo; OrbitPartId: 3; PartId: 0; Type: Silkscreen; Subtype: Logo
*#2 = 7: Pillon Holdings Logo; OrbitPartId: 7; PartId: 0; Type: Silkscreen; Subtype: Logo
*#3 = 5: UBC Logo; OrbitPartId: 5; PartId: 0; Type: Silkscreen; Subtype: Logo
*#4 = 8: TRIUMF Logo; OrbitPartId: 8; PartId: 0; Type: Silkscreen; Subtype: Logo
*#5 = 6: RSL Logo; OrbitPartId: 6; PartId: 0; Type: Silkscreen; Subtype: Logo
? = 9: CSA Logo; OrbitPartId: 9; PartId: 0; Type: Silkscreen; Subtype: Logo
C19 C34 = 0603 Capacitor Template: Chip Capacitor, 0603, ??nF, 10V, X7R; EIA Code: X7R; Max. Voltage: 10V
C48-C53 = 13: as C1 on sheet MCU; EIA Code: X7R; Max. Voltage: 10V; PartId: 1; Subtype: Capacitor
J3-J5 = Header 3X2: Header, 3-Pin, Dual row; LatestRevisionDate: 17-Jul-2002; LatestRevisionNote: Re-released for DXP Platform.; Publisher: Altium Limited
R8 R9 R14 R15 = 2512 Template: Chip Resistor, 2515, ??k ohms

## Sheet CURRENT_SENSE.SchDoc
size A4
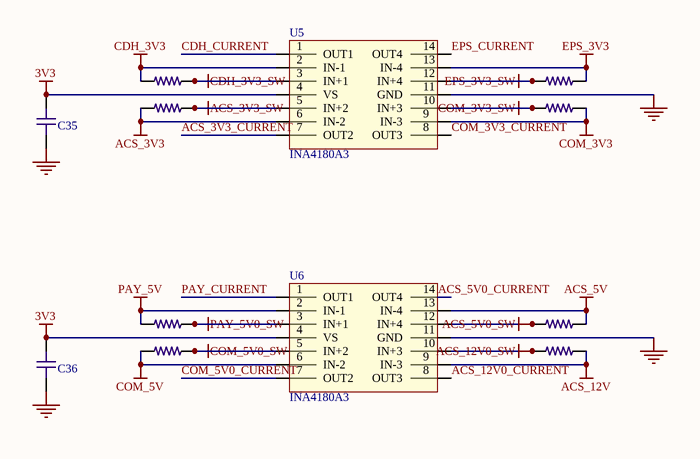
[diagram p8: CURRENT_SENSE.SchDoc]

### Parts
C35  Capacitor  [C0603-IPC]  (value not drawn)
C36  Capacitor  [C0603-IPC]  (value not drawn)
R16  2512 Template  [R2512-IPC]  (value not drawn)
R17  2512 Template  [R2512-IPC]  (value not drawn)
R18  2512 Template  [R2512-IPC]  (value not drawn)
R19  2512 Template  [R2512-IPC]  (value not drawn)
R20  2512 Template  [R2512-IPC]  (value not drawn)
R21  2512 Template  [R2512-IPC]  (value not drawn)
R22  2512 Template  [R2512-IPC]  (value not drawn)
R23  2512 Template  [R2512-IPC]  (value not drawn)
U5  INA4180A3  [TSSOP14]
U6  INA4180A3  [TSSOP14]

### Nets
3V3: C35.2 C36.2 U5.4(VS) U6.4(VS)
ACS_3V3: R18.1 U5.6(IN-2)
ACS_3V3_SW: R18.2 U5.5(IN+2)
ACS_5V: R21.2 U6.13(IN-4)
ACS_5V0_SW: R21.1 U6.12(IN+4)
ACS_12V: R23.2 U6.9(IN-3)
ACS_12V0_SW: R23.1 U6.10(IN+3)
CDH_3V3: R16.1 U5.2(IN-1)
CDH_3V3_SW: R16.2 U5.3(IN+1)
COM_3V3: R19.2 U5.9(IN-3)
COM_3V3_SW: R19.1 U5.10(IN+3)
COM_5V: R22.1 U6.6(IN-2)
COM_5V0_SW: R22.2 U6.5(IN+2)
EPS_3V3: R17.2 U5.13(IN-4)
EPS_3V3_SW: R17.1 U5.12(IN+4)
GND: C35.1 C36.1 U5.11(GND) U6.11(GND)
PAY_5V: R20.1 U6.2(IN-1)
PAY_5V0_SW: R20.2 U6.3(IN+1)
ACS_3V3_CURRENT: U5.7(OUT2)
ACS_5V0_CURRENT: U6.14(OUT4)
ACS_12V0_CURRENT: U6.8(OUT3)
CDH_CURRENT: U5.1(OUT1)
COM_3V3_CURRENT: U5.8(OUT3)
COM_5V0_CURRENT: U6.7(OUT2)
EPS_CURRENT: U5.14(OUT4)
PAY_CURRENT: U6.1(OUT1)

### Library data of the parts
C35 C36 = 13: as C1 on sheet MCU; EIA Code: X7R; Max. Voltage: 10V; Value: 100nF; PartId: 1; Subtype: Capacitor
R16-R23 = 2512 Template: Chip Resistor, 2512, 30 mohms; Value: 0.03
U5 U6 = INA4180: INA4180 4 channel current sense IC. A3(100 V/V); ComponentLink1Description: Datasheet; ComponentLink1URL: http://www.ti.com/lit/ds/symlink/ina4180.pdf

## Nets that join several sheets
3V3: 3V3_PCM (13 pins), MCU (35 pins), CONNECTORS (P1.7 P1.8), SHARED_HEADER (J2.28), JUMPERS (C48.1 C52.2 C53.2), CURRENT_SENSE (C35.2 C36.2 U5.4 U6.4)
5V0: 5V0_PCM (11 pins), SHARED_HEADER (J2.25 J2.26), JUMPERS (5 pins)
12V0: 12V_PCM (C44.2 U14.1), CONNECTORS (J7.1 J9.1), SHARED_HEADER (J2.23 J2.24), JUMPERS (C50.2 C51.2 J5.5 J5.6)
ACS_3V3: SHARED_HEADER (J2.19), CURRENT_SENSE (R18.1 U5.6)
ACS_3V3_SW: 3V3_PCM (D5.A U10.6), CURRENT_SENSE (R18.2 U5.5)
ACS_5V: SHARED_HEADER (J2.13), CURRENT_SENSE (R21.2 U6.13)
ACS_5V0_SW: 5V0_PCM (D9.A U12.6), CURRENT_SENSE (R21.1 U6.12)
ACS_12V: SHARED_HEADER (J2.8), CURRENT_SENSE (R23.2 U6.9)
ACS_12V0_SW: 12V_PCM (D10.A U14.6), CURRENT_SENSE (R23.1 U6.10)
CDH_3V3: SHARED_HEADER (J2.27), CURRENT_SENSE (R16.1 U5.2)
CDH_3V3_SW: 3V3_PCM (D3.A U7.6), CURRENT_SENSE (R16.2 U5.3)
COM_3V3: SHARED_HEADER (J2.20), CURRENT_SENSE (R19.2 U5.9)
COM_3V3_SW: 3V3_PCM (D6.A U9.6), CURRENT_SENSE (R19.1 U5.10)
COM_5V: SHARED_HEADER (J2.15), CURRENT_SENSE (R22.1 U6.6)
COM_5V0_SW: 5V0_PCM (D8.A U13.6), CURRENT_SENSE (R22.2 U6.5)
EPS_3V3_SW: 3V3_PCM (D4.A U8.6), CURRENT_SENSE (R17.1 U5.12)
GND: 5V0_PCM (17 pins), 12V_PCM (C44.1 R35.2 U14.2), 3V3_PCM (20 pins), MCU (34 pins), CONNECTORS (11 pins), SHARED_HEADER (21 pins), JUMPERS (C19.2 C34.2), CURRENT_SENSE (C35.1 C36.1 U5.11 U6.11)
PAY_5V: SHARED_HEADER (J2.16), CURRENT_SENSE (R20.1 U6.2)
PAY_5V0_SW: 5V0_PCM (D7.A U11.6), CURRENT_SENSE (R20.2 U6.3)
USB_VCC: CONNECTORS (C46.2 J6.1), JUMPERS (J5.1 J5.2)
VCC_IN: 5V0_PCM (5 pins), 3V3_PCM (5 pins), JUMPERS (C48.2 C49.2 J5.3 J5.4)
ACS_3V3_CURRENT: MCU (U1.44), CURRENT_SENSE (U5.7)
ACS_3V3_EN: 3V3_PCM (U10.3), MCU (U1.11)
ACS_5V0_CURRENT: MCU (U1.37), CURRENT_SENSE (U6.14)
ACS_5V0_EN: 5V0_PCM (U12.3), MCU (U1.20)
ACS_12V0_CURRENT: MCU (U1.35), CURRENT_SENSE (U6.8)
ACS_12V0_EN: 12V_PCM (U14.3), MCU (U1.21)
ADCS_GPIO_1: MCU (U1.80), SHARED_HEADER (J1.28)
ADCS_GPIO_2: MCU (U1.81), SHARED_HEADER (J1.30)
CAN_H: MCU (U2.7), CONNECTORS (P2.7), SHARED_HEADER (J1.3), JUMPERS (R8.2 R14.2)
CAN_L: MCU (U2.6), CONNECTORS (P2.2), SHARED_HEADER (J1.5), JUMPERS (R9.1 R15.1)
CDH_CS: MCU (U1.102), SHARED_HEADER (J1.45)
CDH_CURRENT: MCU (U1.49), CURRENT_SENSE (U5.1)
CDH_GPIO_1: MCU (U1.58), SHARED_HEADER (J1.38)
CDH_GPIO_2: MCU (U1.59), SHARED_HEADER (J1.40)
CDH_GPIO_3: MCU (U1.60), SHARED_HEADER (J1.44)
CDH_GPIO_4: MCU (U1.63), SHARED_HEADER (J1.46)
CDH_MISO: MCU (U1.42), SHARED_HEADER (J1.49)
CDH_MOSI: MCU (U1.43), SHARED_HEADER (J1.47)
CDH_PWR_EN: 3V3_PCM (U7.3), MCU (U1.10)
CDH_SCLK: MCU (U1.41), SHARED_HEADER (J1.51)
COM_3V3_CURRENT: MCU (U1.45), CURRENT_SENSE (U5.8)
COM_3V3_EN: 3V3_PCM (U9.3), MCU (U1.13)
COM_5V0_CURRENT: MCU (U1.36), CURRENT_SENSE (U6.7)
COM_5V0_EN: 5V0_PCM (U13.3), MCU (U1.15)
COMMS_IRQ_1: MCU (U1.85), SHARED_HEADER (J1.21)
COMMS_IRQ_2: MCU (U1.86), SHARED_HEADER (J1.22)
EPS_3V3_EN: 3V3_PCM (U8.3), MCU (U1.12)
EPS_CURRENT: MCU (U1.50), CURRENT_SENSE (U5.14)
EPS_I2C_SCL: MCU (R7.1 U1.139), SHARED_HEADER (J1.43)
EPS_I2C_SDA: MCU (R6.1 U1.140), SHARED_HEADER (J1.41)
MCU_SWCLK: MCU (U1.109), CONNECTORS (P1.6)
MCU_SWDIO: MCU (U1.105), CONNECTORS (P1.2)
NRST: MCU (C17.1 S1.1 U1.25), CONNECTORS (P1.1)
PAY_5V0_EN: 5V0_PCM (U11.3), MCU (U1.14)
PAY_CURRENT: MCU (U1.26), CURRENT_SENSE (U6.1)
PAY_PWR_FLT: MCU (U1.65), SHARED_HEADER (J1.50)
PAY_UART_RX: MCU (U1.18), SHARED_HEADER (J1.9)
PAY_UART_TX: MCU (U1.19), SHARED_HEADER (J1.11)
PAY_USB_BOOT_EN: MCU (U1.64), SHARED_HEADER (J1.48)
PAY_USB_D_N: MCU (U1.103), SHARED_HEADER (J1.15)
PAY_USB_D_P: MCU (U1.104), SHARED_HEADER (J1.17)
PAY_WDO: MCU (U1.82), SHARED_HEADER (J1.19)
USART3_RX: MCU (U1.78), CONNECTORS (R29.1 U15.1)
USART3_TX: MCU (U1.77), CONNECTORS (R31.1 U15.4)